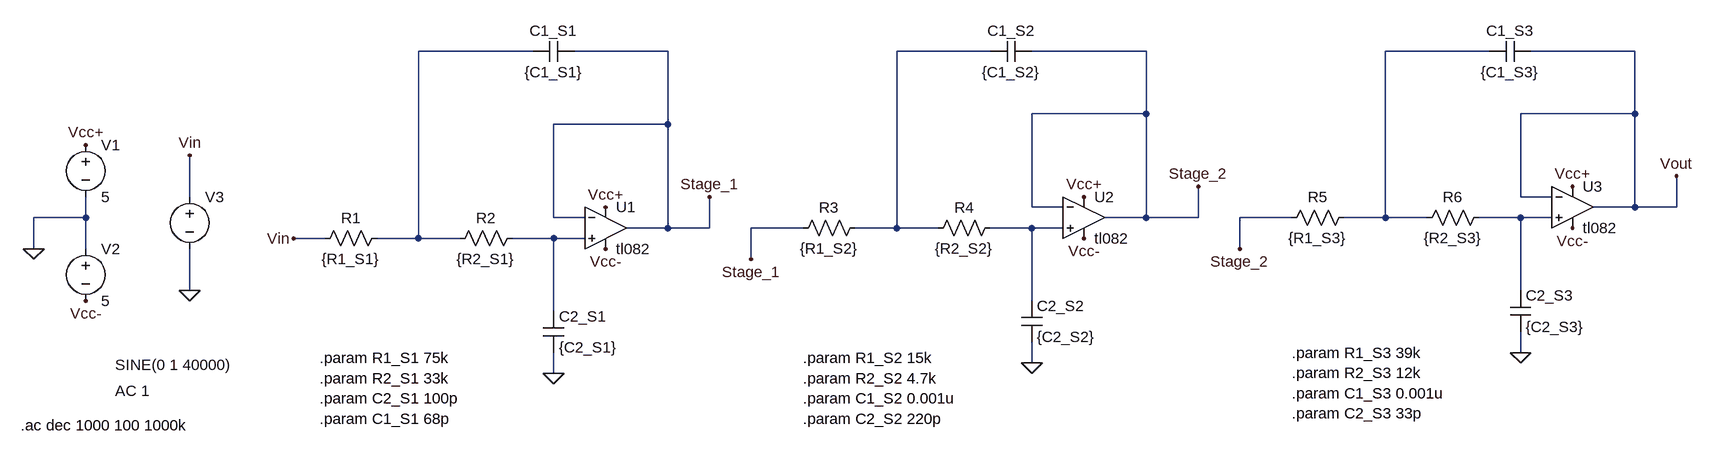
[diagram p0: schematic Filtro_V4.asc]
Filtro_V4.asc, the LTspice schematic file:
Version 4
SHEET 1 1584 680
WIRE -480 -192 -656 -192
WIRE -272 -192 -416 -192
WIRE 224 -192 80 -192
WIRE 464 -192 288 -192
WIRE 992 -192 832 -192
WIRE 1216 -192 1056 -192
WIRE 464 -96 464 -192
WIRE 464 -96 288 -96
WIRE 1216 -96 1216 -192
WIRE 1216 -96 1040 -96
WIRE -272 -80 -272 -192
WIRE -272 -80 -448 -80
WIRE -1008 32 -1008 -32
WIRE 1040 32 1040 -96
WIRE 1088 32 1040 32
WIRE 288 48 288 -96
WIRE 336 48 288 48
WIRE 1216 48 1216 -96
WIRE 1216 48 1152 48
WIRE 1280 48 1280 0
WIRE 1280 48 1216 48
WIRE -1168 64 -1168 32
WIRE -1168 64 -1248 64
WIRE -448 64 -448 -80
WIRE -400 64 -448 64
WIRE 464 64 464 -96
WIRE 464 64 400 64
WIRE 544 64 544 16
WIRE 544 64 464 64
WIRE 688 64 608 64
WIRE 832 64 832 -192
WIRE 832 64 768 64
WIRE 896 64 832 64
WIRE 1040 64 976 64
WIRE 1088 64 1040 64
WIRE -272 80 -272 -80
WIRE -272 80 -336 80
WIRE -208 80 -208 32
WIRE -208 80 -272 80
WIRE -64 80 -144 80
WIRE 80 80 80 -192
WIRE 80 80 16 80
WIRE 144 80 80 80
WIRE 288 80 224 80
WIRE 336 80 288 80
WIRE -800 96 -848 96
WIRE -656 96 -656 -192
WIRE -656 96 -720 96
WIRE -592 96 -656 96
WIRE -448 96 -512 96
WIRE -400 96 -448 96
WIRE -1248 112 -1248 64
WIRE -1168 112 -1168 64
WIRE 608 112 608 64
WIRE -144 128 -144 80
WIRE -1008 176 -1008 112
WIRE 1040 176 1040 64
WIRE 288 192 288 80
WIRE -448 208 -448 96
WIRE 1040 272 1040 240
WIRE 288 288 288 256
WIRE -448 304 -448 272
FLAG -448 304 0
FLAG -1248 112 0
FLAG -1168 -48 Vcc+
FLAG -1168 192 Vcc-
FLAG -368 48 Vcc+
FLAG -368 112 Vcc-
FLAG -848 96 Vin
FLAG -1008 176 0
FLAG -1008 -32 Vin
FLAG 288 288 0
FLAG 368 32 Vcc+
FLAG 368 96 Vcc-
FLAG 1040 272 0
FLAG 1120 16 Vcc+
FLAG 1120 80 Vcc-
FLAG 1280 0 Vout
FLAG -208 32 Stage_1
FLAG -144 128 Stage_1
FLAG 544 16 Stage_2
FLAG 608 112 Stage_2
SYMBOL tl082 -368 80 R0
SYMATTR InstName U1
SYMBOL res -704 80 R90
WINDOW 0 0 56 VBottom 2
WINDOW 3 32 56 VTop 2
SYMATTR InstName R1
SYMATTR Value {R1_S1}
SYMBOL cap -464 208 R0
SYMATTR InstName C2_S1
SYMATTR Value {C2_S1}
SYMBOL res -496 80 R90
WINDOW 0 0 56 VBottom 2
WINDOW 3 32 56 VTop 2
SYMATTR InstName R2
SYMATTR Value {R2_S1}
SYMBOL voltage -1168 -64 R0
SYMATTR InstName V1
SYMATTR Value 5
SYMBOL voltage -1168 96 R0
SYMATTR InstName V2
SYMATTR Value 5
SYMBOL voltage -1008 16 R0
WINDOW 3 -115 275 Left 2
WINDOW 123 -115 315 Left 2
WINDOW 39 0 0 Left 0
SYMATTR InstName V3
SYMATTR Value SINE(0 1 40000)
SYMATTR Value2 AC 1
SYMBOL tl082 368 64 R0
SYMATTR InstName U2
SYMBOL res 32 64 R90
WINDOW 0 0 56 VBottom 2
WINDOW 3 32 56 VTop 2
SYMATTR InstName R3
SYMATTR Value {R1_S2}
SYMBOL cap 272 192 R0
SYMATTR InstName C2_S2
SYMATTR Value {C2_S2}
SYMBOL res 240 64 R90
WINDOW 0 0 56 VBottom 2
WINDOW 3 32 56 VTop 2
SYMATTR InstName R4
SYMATTR Value {R2_S2}
SYMBOL tl082 1120 48 R0
SYMATTR InstName U3
SYMBOL res 784 48 R90
WINDOW 0 0 56 VBottom 2
WINDOW 3 32 56 VTop 2
SYMATTR InstName R5
SYMATTR Value {R1_S3}
SYMBOL cap 1024 176 R0
SYMATTR InstName C2_S3
SYMATTR Value {C2_S3}
SYMBOL res 992 48 R90
WINDOW 0 0 56 VBottom 2
WINDOW 3 32 56 VTop 2
SYMATTR InstName R6
SYMATTR Value {R2_S3}
SYMBOL cap -416 -208 R90
WINDOW 0 0 32 VBottom 2
WINDOW 3 32 32 VTop 2
SYMATTR InstName C1_S1
SYMATTR Value {C1_S1}
SYMBOL cap 288 -208 R90
WINDOW 0 0 32 VBottom 2
WINDOW 3 32 32 VTop 2
SYMATTR InstName C1_S2
SYMATTR Value {C1_S2}
SYMBOL cap 1056 -208 R90
WINDOW 0 0 32 VBottom 2
WINDOW 3 32 32 VTop 2
SYMATTR InstName C1_S3
SYMATTR Value {C1_S3}
TEXT -808 280 Left 2 !.param R1_S1 75k\n.param R2_S1 33k\n.param C2_S1 100p\n.param C1_S1 68p
TEXT -64 280 Left 2 !.param R1_S2 15k\n.param R2_S2 4.7k\n.param C1_S2 0.001u\n.param C2_S2 220p
TEXT 688 272 Left 2 !.param R1_S3 39k\n.param R2_S3 12k\n.param C1_S3 0.001u\n.param C2_S3 33p
TEXT -1268 384 Left 2 !.ac dec 1000 100 1000k

The netlist it stands for:
* Filtro_V4.asc
* U1: tl082 (symbol tl082 not available, pins judged from their places): In+=N006 In-=Stage_1 V+=Vcc+ V-=Vcc- OUT=Stage_1
R1 N001 Vin {R1_S1}
C2_S1 N006 0 {C2_S1}
R2 N006 N001 {R2_S1}
V1 Vcc+ 0 5
V2 0 Vcc- 5
V3 Vin 0 SINE(0 1 40000) AC 1
* U2: tl082 (symbol tl082 not available, pins judged from their places): In+=N005 In-=Stage_2 V+=Vcc+ V-=Vcc- OUT=Stage_2
R3 N002 Stage_1 {R1_S2}
C2_S2 N005 0 {C2_S2}
R4 N005 N002 {R2_S2}
* U3: tl082 (symbol tl082 not available, pins judged from their places): In+=N004 In-=Vout V+=Vcc+ V-=Vcc- OUT=Vout
R5 N003 Stage_2 {R1_S3}
C2_S3 N004 0 {C2_S3}
R6 N004 N003 {R2_S3}
C1_S1 Stage_1 N001 {C1_S1}
C1_S2 Stage_2 N002 {C1_S2}
C1_S3 Vout N003 {C1_S3}
.param R1_S1 75k
.param R2_S1 33k
.param C2_S1 100p
.param C1_S1 68p
.param R1_S2 15k
.param R2_S2 4.7k
.param C1_S2 0.001u
.param C2_S2 220p
.param R1_S3 39k
.param R2_S3 12k
.param C1_S3 0.001u
.param C2_S3 33p
.ac dec 1000 100 1000k
.backanno
.end